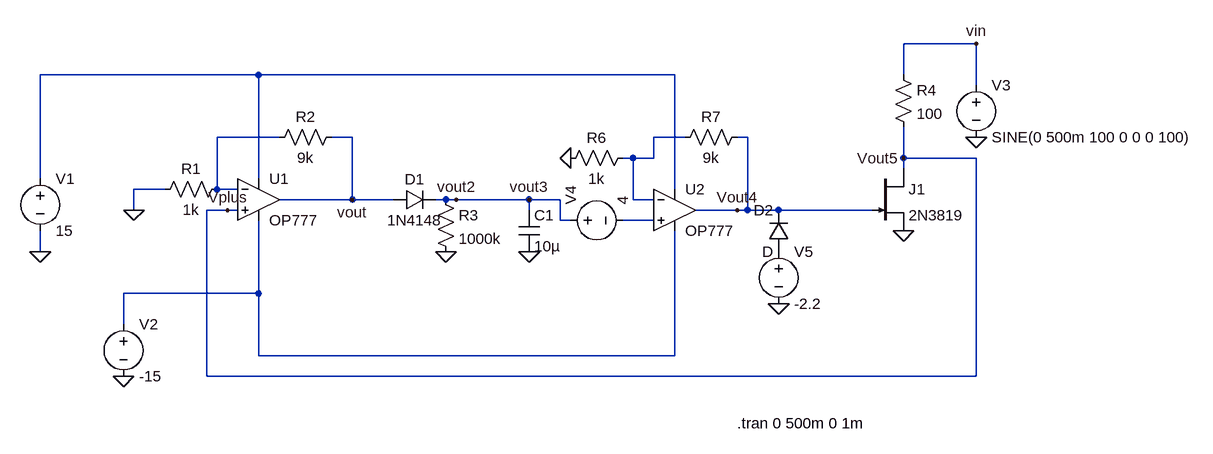
[diagram p0: schematic AGC.asc]
AGC.asc, the LTspice schematic file:
Version 4
SHEET 1 1144 680
WIRE 784 -160 672 -160
WIRE -320 -112 -656 -112
WIRE 320 -112 -320 -112
WIRE 672 -112 672 -160
WIRE 784 -96 784 -160
WIRE -288 -16 -384 -16
WIRE -176 -16 -208 -16
WIRE 336 -16 288 -16
WIRE 432 -16 416 -16
WIRE 256 16 240 16
WIRE 288 16 288 -16
WIRE 288 16 256 16
WIRE 672 16 672 -32
WIRE 784 16 672 16
WIRE 672 32 672 16
WIRE -656 48 -656 -112
WIRE -320 48 -320 -112
WIRE -464 64 -512 64
WIRE -384 64 -384 -16
WIRE -352 64 -384 64
WIRE 320 64 320 -112
WIRE -176 80 -176 -16
WIRE -176 80 -288 80
WIRE -112 80 -176 80
WIRE -32 80 -48 80
WIRE -16 80 -32 80
WIRE 96 80 -16 80
WIRE 144 80 96 80
WIRE 256 80 256 16
WIRE 288 80 256 80
WIRE -512 96 -512 64
WIRE -368 96 -400 96
WIRE -352 96 -368 96
WIRE 96 96 96 80
WIRE 416 96 352 96
WIRE 432 96 432 -16
WIRE 432 96 416 96
WIRE 480 96 432 96
WIRE 624 96 480 96
WIRE 144 112 144 80
WIRE 160 112 144 112
WIRE 288 112 240 112
WIRE -656 160 -656 128
WIRE -320 224 -320 112
WIRE -320 224 -528 224
WIRE -528 272 -528 224
WIRE -320 320 -320 224
WIRE 320 320 320 128
WIRE 320 320 -320 320
WIRE -400 352 -400 96
WIRE 784 352 784 16
WIRE 784 352 -400 352
FLAG -656 160 0
FLAG -528 352 0
FLAG -512 96 0
FLAG 784 -16 0
FLAG -176 80 vout
FLAG 784 -160 vin
FLAG -16 80 vout2
FLAG -32 160 0
FLAG 96 160 0
FLAG 96 80 vout3
FLAG 416 96 Vout4
FLAG 480 240 0
FLAG 672 128 0
FLAG 672 16 Vout5
FLAG -368 96 Vplus
FLAG 160 16 0
SYMBOL Opamps\\OP777 -320 16 R0
SYMATTR InstName U1
SYMBOL voltage -656 32 R0
WINDOW 123 0 0 Left 0
WINDOW 39 0 0 Left 0
SYMATTR InstName V1
SYMATTR Value 15
SYMBOL voltage -528 256 R0
WINDOW 123 0 0 Left 0
WINDOW 39 0 0 Left 0
SYMATTR InstName V2
SYMATTR Value -15
SYMBOL res -368 48 R90
WINDOW 0 0 56 VBottom 2
WINDOW 3 32 56 VTop 2
SYMATTR InstName R1
SYMATTR Value 1k
SYMBOL res -192 -32 R90
WINDOW 0 0 56 VBottom 2
WINDOW 3 32 56 VTop 2
SYMATTR InstName R2
SYMATTR Value 9k
SYMBOL voltage 784 -112 R0
WINDOW 123 0 0 Left 0
WINDOW 39 0 0 Left 0
SYMATTR InstName V3
SYMATTR Value SINE(0 500m 100 0 0 0 100)
SYMBOL diode -112 96 R270
WINDOW 0 32 32 VTop 2
WINDOW 3 0 32 VBottom 2
SYMATTR InstName D1
SYMATTR Value 1N4148
SYMBOL res -48 64 R0
SYMATTR InstName R3
SYMATTR Value 1000k
SYMBOL cap 80 96 R0
SYMATTR InstName C1
SYMATTR Value 10µ
SYMBOL Opamps\\OP777 320 32 R0
SYMATTR InstName U2
SYMBOL voltage 144 112 R270
WINDOW 123 0 0 Left 0
WINDOW 39 0 0 Left 0
SYMATTR InstName V4
SYMATTR Value 4
SYMBOL njf 624 32 R0
SYMATTR InstName J1
SYMATTR Value 2N3819
SYMBOL voltage 480 144 R0
WINDOW 123 0 0 Left 0
WINDOW 39 0 0 Left 0
SYMATTR InstName V5
SYMATTR Value -2.2
SYMBOL res 656 -128 R0
SYMATTR InstName R4
SYMATTR Value 100
SYMBOL res 432 -32 R90
WINDOW 0 0 56 VBottom 2
WINDOW 3 32 56 VTop 2
SYMATTR InstName R7
SYMATTR Value 9k
SYMBOL res 256 0 R90
WINDOW 0 0 56 VBottom 2
WINDOW 3 32 56 VTop 2
SYMATTR InstName R6
SYMATTR Value 1k
SYMBOL diode 496 160 R180
WINDOW 0 24 64 Left 2
WINDOW 3 24 0 Left 2
SYMATTR InstName D2
TEXT 416 424 Left 2 !.tran 0 500m 0 1m

The netlist it stands for:
* AGC.asc
XU1 Vplus N002 N001 N005 vout OP777  ; pins In+ In- V+ V- OUT
V1 N001 0 15
V2 N005 0 -15
R1 N002 0 1k
R2 vout N002 9k
V3 vin 0 SINE(0 500m 100 0 0 0 100)
D1 vout vout3 1N4148
R3 vout3 0 1000k
C1 vout3 0 10µ
XU2 N004 N003 N001 N005 Vout4 OP777  ; pins In+ In- V+ V- OUT
V4 vout3 N004 4
J1 Vplus Vout4 0 2N3819
V5 P001 0 -2.2
R4 vin Vplus 100
R7 Vout4 N003 9k
R6 N003 0 1k
D2 P001 Vout4 D
.model D D
.lib standard.dio
.model NJF NJF
.model PJF PJF
.lib standard.jft
.tran 0 500m 0 1m
.lib ADI.lib
.backanno
.end